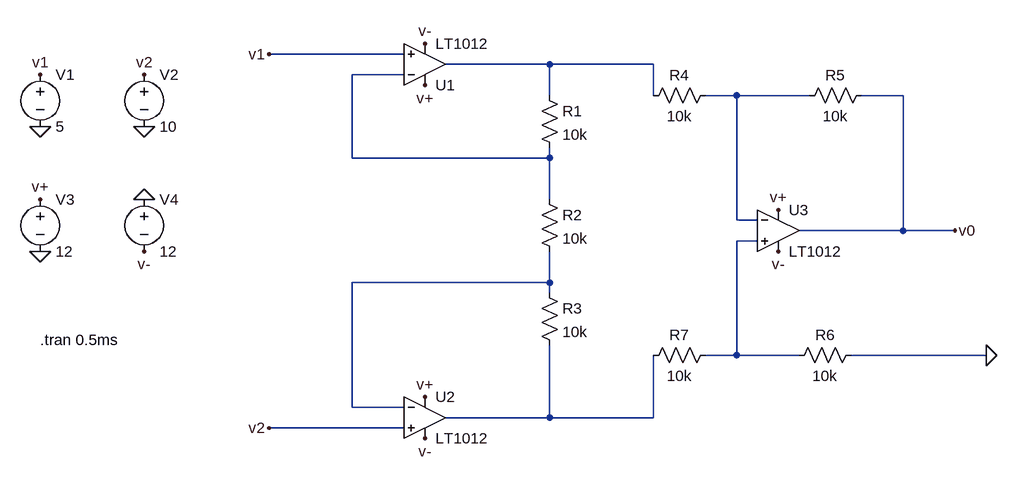
[diagram p0: schematic notes circuit instrumentation amplifier.asc]
notes circuit instrumentation amplifier.asc, the LTspice schematic file:
Version 4
SHEET 1 1108 740
WIRE 192 80 -16 80
WIRE 416 96 256 96
WIRE 576 96 416 96
WIRE 192 112 112 112
WIRE 416 144 416 96
WIRE 576 144 576 96
WIRE 704 144 656 144
WIRE 816 144 704 144
WIRE 960 144 896 144
WIRE 112 240 112 112
WIRE 416 240 416 224
WIRE 416 240 112 240
WIRE 416 304 416 240
WIRE 704 336 704 144
WIRE 736 336 704 336
WIRE 960 352 960 144
WIRE 960 352 800 352
WIRE 1040 352 960 352
WIRE 736 368 704 368
WIRE 416 432 416 384
WIRE 416 432 112 432
WIRE 416 448 416 432
WIRE 704 544 704 368
WIRE 704 544 656 544
WIRE 800 544 704 544
WIRE 1088 544 880 544
WIRE 112 624 112 432
WIRE 192 624 112 624
WIRE 416 640 416 528
WIRE 416 640 256 640
WIRE 576 640 576 544
WIRE 576 640 416 640
WIRE 192 656 -16 656
FLAG 1088 544 0
FLAG -16 80 v1
FLAG -16 656 v2
FLAG 1040 352 v0
FLAG 224 64 v-
FLAG 224 672 v-
FLAG 768 384 v-
FLAG 224 128 v+
FLAG 224 608 v+
FLAG 768 320 v+
FLAG -368 112 v1
FLAG -208 112 v2
FLAG -368 192 0
FLAG -208 192 0
FLAG -368 304 v+
FLAG -208 384 v-
FLAG -368 384 0
FLAG -208 304 0
SYMBOL OpAmps\\LT1012 224 160 M180
SYMATTR InstName U1
SYMBOL OpAmps\\LT1012 224 576 R0
SYMATTR InstName U2
SYMBOL OpAmps\\LT1012 768 288 R0
SYMATTR InstName U3
SYMBOL res 400 128 R0
SYMATTR InstName R1
SYMATTR Value 10k
SYMBOL res 400 288 R0
SYMATTR InstName R2
SYMATTR Value 10k
SYMBOL res 400 432 R0
SYMATTR InstName R3
SYMATTR Value 10k
SYMBOL res 672 128 R90
WINDOW 0 0 56 VBottom 2
WINDOW 3 32 56 VTop 2
SYMATTR InstName R4
SYMATTR Value 10k
SYMBOL res 912 128 R90
WINDOW 0 0 56 VBottom 2
WINDOW 3 32 56 VTop 2
SYMATTR InstName R5
SYMATTR Value 10k
SYMBOL res 896 528 R90
WINDOW 0 0 56 VBottom 2
WINDOW 3 32 56 VTop 2
SYMATTR InstName R6
SYMATTR Value 10k
SYMBOL res 672 528 R90
WINDOW 0 0 56 VBottom 2
WINDOW 3 32 56 VTop 2
SYMATTR InstName R7
SYMATTR Value 10k
SYMBOL voltage -368 96 R0
WINDOW 123 0 0 Left 0
WINDOW 39 0 0 Left 0
SYMATTR InstName V1
SYMATTR Value 5
SYMBOL voltage -208 96 R0
WINDOW 123 0 0 Left 0
WINDOW 39 0 0 Left 0
SYMATTR InstName V2
SYMATTR Value 10
SYMBOL voltage -368 288 R0
WINDOW 123 0 0 Left 0
WINDOW 39 0 0 Left 0
SYMATTR InstName V3
SYMATTR Value 12
SYMBOL voltage -208 288 R0
WINDOW 123 0 0 Left 0
WINDOW 39 0 0 Left 0
SYMATTR InstName V4
SYMATTR Value 12
TEXT -368 520 Left 2 !.tran 0.5ms

The netlist it stands for:
* notes circuit instrumentation amplifier.asc
XU1 v1 N002 v+ v- N001 LT1012  ; pins In+ In- V+ V- OUT
XU2 v2 N005 v+ v- N006 LT1012  ; pins In+ In- V+ V- OUT
XU3 N004 N003 v+ v- v0 LT1012  ; pins In+ In- V+ V- OUT
R1 N001 N002 10k
R2 N002 N005 10k
R3 N005 N006 10k
R4 N003 N001 10k
R5 v0 N003 10k
R6 0 N004 10k
R7 N004 N006 10k
V1 v1 0 5
V2 v2 0 10
V3 v+ 0 12
V4 0 v- 12
.tran 0.5ms
.backanno
.end